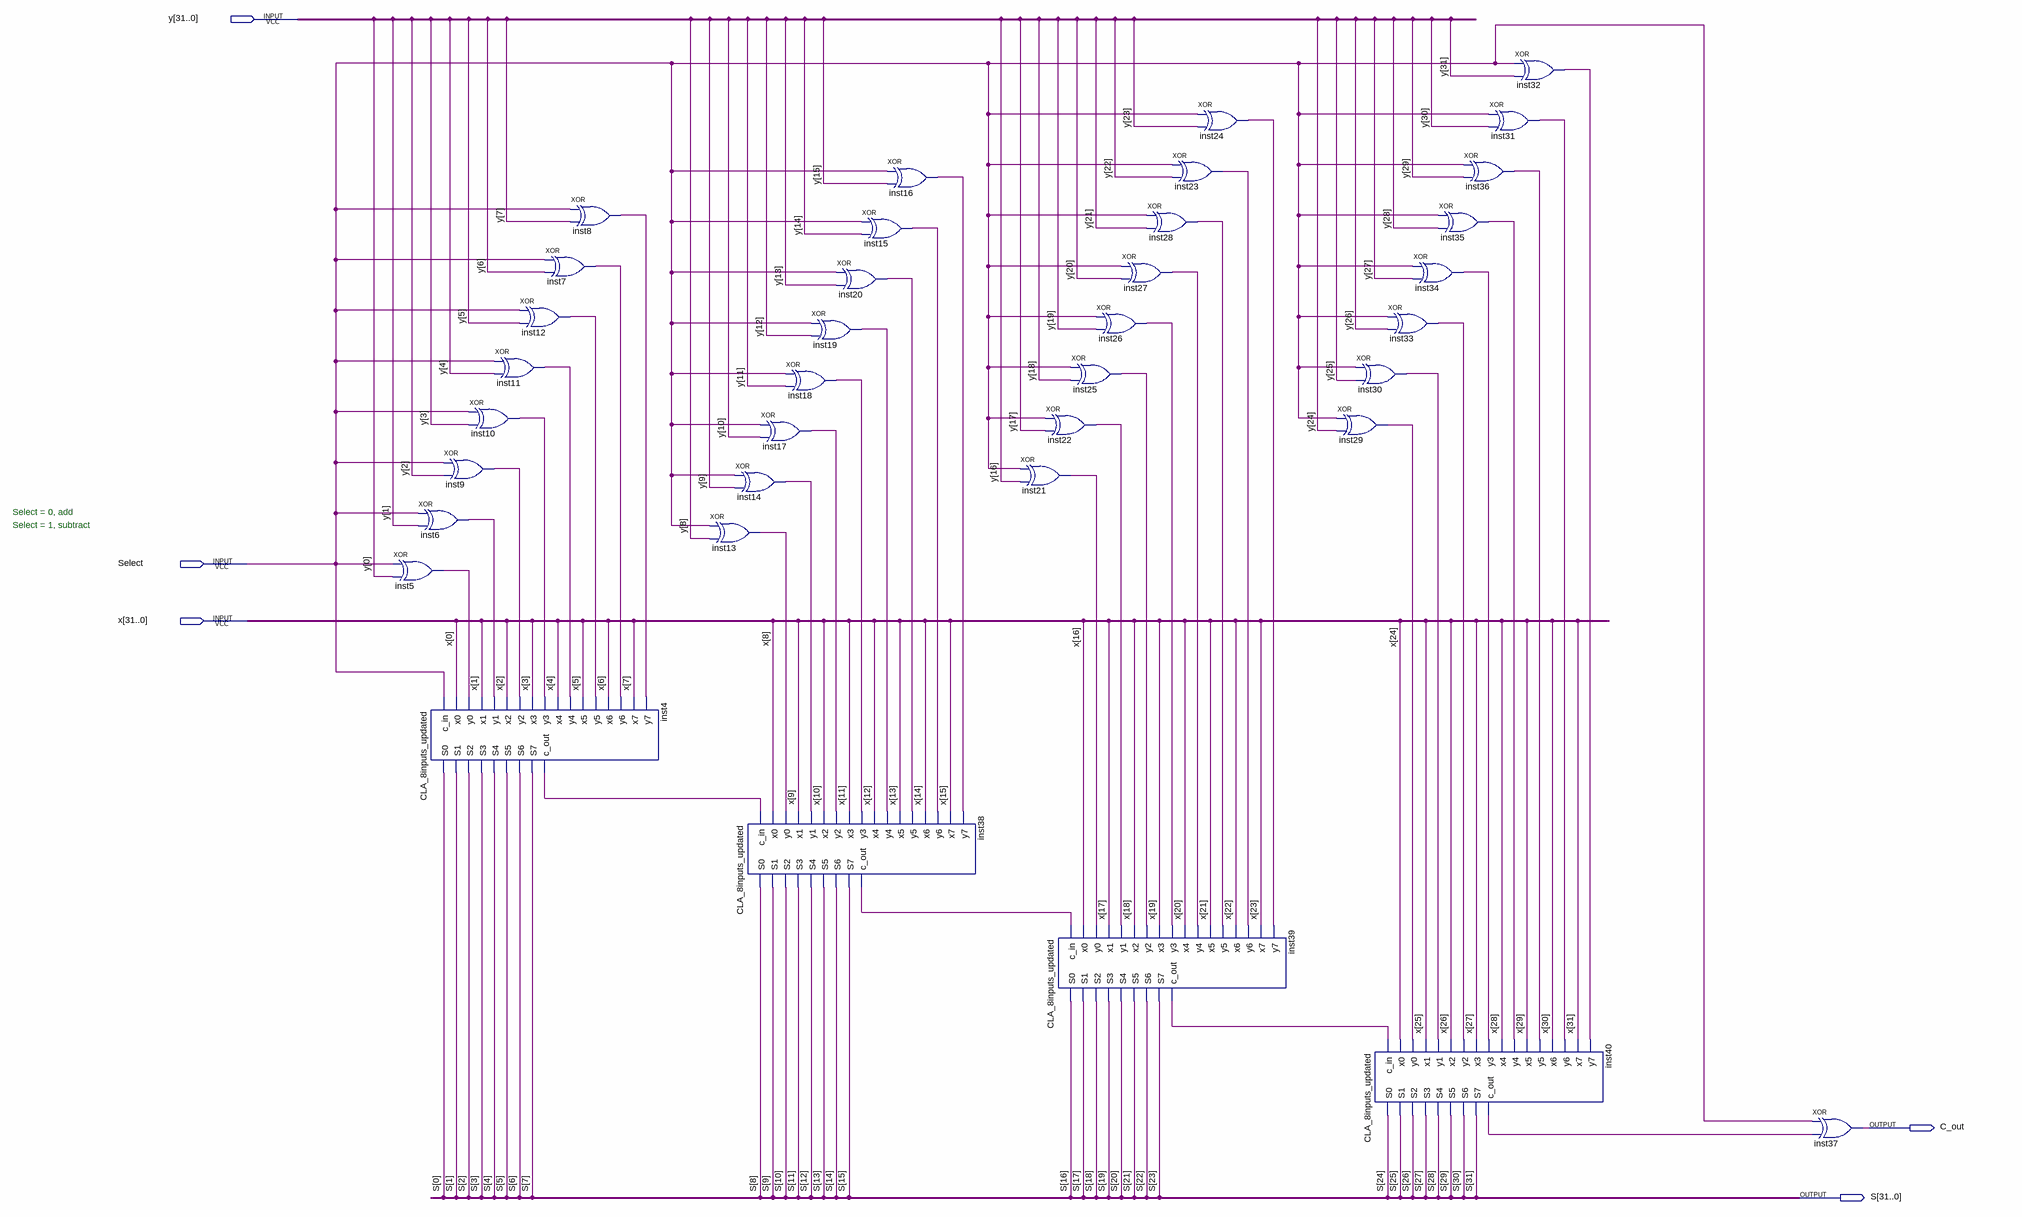
[diagram p0: schematic sheet]
// Quartus schematic Hierarchical_CLA.bdf as structural Verilog: 37 symbols, 5 pins
module Hierarchical_CLA (
  input  [31:0] y,
  input  Select,
  input  [31:0] x,
  output C_out,
  output [31:0] S
);

  wire inst4_c_out, inst5_out, inst6_out, inst7_out, inst8_out, inst9_out, inst10_out, inst11_out,
       inst12_out, inst13_out, inst14_out, inst15_out, inst16_out, inst17_out, inst18_out, inst19_out,
       inst20_out, inst21_out, inst22_out, inst23_out, inst24_out, inst25_out, inst26_out, inst27_out,
       inst28_out, inst29_out, inst30_out, inst31_out, inst32_out, inst33_out, inst34_out, inst35_out,
       inst36_out, inst38_c_out, inst39_c_out, inst40_c_out;

  xor inst6 (inst6_out, Select, y[1]);
  xor inst5 (inst5_out, Select, y[0]);
  CLA_8inputs_updated inst4 (
    .c_in(Select), .x0(x[0]), .y0(inst5_out), .x1(x[1]), .y1(inst6_out), .x2(x[2]), .y2(inst9_out),
    .x3(x[3]), .y3(inst10_out), .x4(x[4]), .y4(inst11_out), .x5(x[5]), .y5(inst12_out), .x6(x[6]),
    .y6(inst7_out), .x7(x[7]), .y7(inst8_out), .S0(S[0]), .S1(S[1]), .S2(S[2]), .S3(S[3]), .S4(S[4]),
    .S5(S[5]), .S6(S[6]), .S7(S[7]), .c_out(inst4_c_out));
  xor inst10 (inst10_out, Select, y[3]);
  xor inst9 (inst9_out, Select, y[2]);
  xor inst12 (inst12_out, Select, y[5]);
  xor inst11 (inst11_out, Select, y[4]);
  xor inst8 (inst8_out, Select, y[7]);
  xor inst7 (inst7_out, Select, y[6]);
  xor inst13 (inst13_out, Select, y[8]);
  xor inst17 (inst17_out, Select, y[10]);
  xor inst14 (inst14_out, Select, y[9]);
  CLA_8inputs_updated inst38 (
    .c_in(inst4_c_out), .x0(x[8]), .y0(inst13_out), .x1(x[9]), .y1(inst14_out), .x2(x[10]), .y2(inst17_out),
    .x3(x[11]), .y3(inst18_out), .x4(x[12]), .y4(inst19_out), .x5(x[13]), .y5(inst20_out), .x6(x[14]),
    .y6(inst15_out), .x7(x[15]), .y7(inst16_out), .S0(S[8]), .S1(S[9]), .S2(S[10]), .S3(S[11]), .S4(S[12]),
    .S5(S[13]), .S6(S[14]), .S7(S[15]), .c_out(inst38_c_out));
  xor inst19 (inst19_out, Select, y[12]);
  xor inst18 (inst18_out, Select, y[11]);
  xor inst15 (inst15_out, Select, y[14]);
  xor inst20 (inst20_out, Select, y[13]);
  xor inst16 (inst16_out, Select, y[15]);
  xor inst21 (inst21_out, Select, y[16]);
  xor inst25 (inst25_out, Select, y[18]);
  xor inst22 (inst22_out, Select, y[17]);
  CLA_8inputs_updated inst39 (
    .c_in(inst38_c_out), .x0(x[16]), .y0(inst21_out), .x1(x[17]), .y1(inst22_out), .x2(x[18]),
    .y2(inst25_out), .x3(x[19]), .y3(inst26_out), .x4(x[20]), .y4(inst27_out), .x5(x[21]), .y5(inst28_out),
    .x6(x[22]), .y6(inst23_out), .x7(x[23]), .y7(inst24_out), .S0(S[16]), .S1(S[17]), .S2(S[18]), .S3(S[19]),
    .S4(S[20]), .S5(S[21]), .S6(S[22]), .S7(S[23]), .c_out(inst39_c_out));
  xor inst27 (inst27_out, Select, y[20]);
  xor inst26 (inst26_out, Select, y[19]);
  xor inst23 (inst23_out, Select, y[22]);
  xor inst28 (inst28_out, Select, y[21]);
  xor inst24 (inst24_out, Select, y[23]);
  xor inst30 (inst30_out, Select, y[25]);
  xor inst29 (inst29_out, Select, y[24]);
  CLA_8inputs_updated inst40 (
    .c_in(inst39_c_out), .x0(x[24]), .y0(inst29_out), .x1(x[25]), .y1(inst30_out), .x2(x[26]),
    .y2(inst33_out), .x3(x[27]), .y3(inst34_out), .x4(x[28]), .y4(inst35_out), .x5(x[29]), .y5(inst36_out),
    .x6(x[30]), .y6(inst31_out), .x7(x[31]), .y7(inst32_out), .S0(S[24]), .S1(S[25]), .S2(S[26]), .S3(S[27]),
    .S4(S[28]), .S5(S[29]), .S6(S[30]), .S7(S[31]), .c_out(inst40_c_out));
  xor inst34 (inst34_out, Select, y[27]);
  xor inst33 (inst33_out, Select, y[26]);
  xor inst36 (inst36_out, Select, y[29]);
  xor inst35 (inst35_out, Select, y[28]);
  xor inst32 (inst32_out, Select, y[31]);
  xor inst31 (inst31_out, Select, y[30]);
  xor inst37 (C_out, Select, inst40_c_out);

  // Notes on the sheet:
  //   Select = 0, add
  //   Select = 1, subtract
endmodule
